# EAGLE schematic nbedmbed_mini (EAGLE 7.1.0)
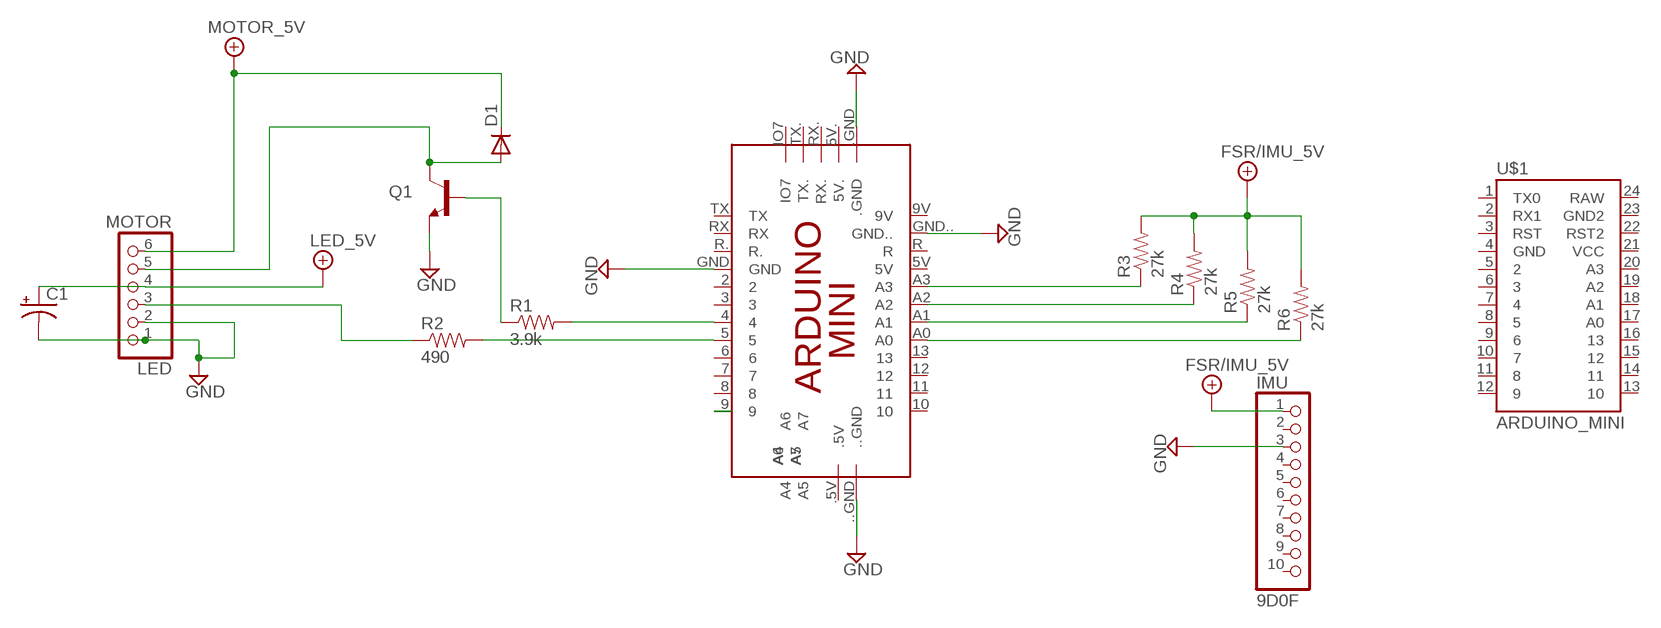
[diagram p0: schematic, sheet 1]

## Parts
C1  CAP_POLPTH1  [CPOL-RADIAL-100UF-25V]
D1  DIODE1N4148  [DIODE-1N4148]
IMU  9D0F  PINHD-1X10  [1X10-BIG]
LED  MOTOR  PINHD-1X6B  [1X06-BIG]
PCB1  ARDUINO_MINI  [ARDUINO_MINI]
Q1  TRANSISTOR_NPNTO-92-AMMO  [TO-92-AMMO]
R1  3.9k  RESISTORPTH-1/6W  [1/6W-RES]
R2  490  RESISTORPTH-1/6W  [1/6W-RES]
R3  27k  RESISTORPTH-1/6W  [1/6W-RES]
R4  27k  RESISTORPTH-1/6W  [1/6W-RES]
R5  27k  RESISTORPTH-1/6W  [1/6W-RES]
R6  27k  RESISTORPTH-1/6W  [1/6W-RES]
U$1  ARDUINO_MINI  [ARDUINO_MINI]

## Nets
FSR/IMU_5V: IMU.1 R3.2 R4.2 R5.2 R6.2
GND: C1.2(-) IMU.3 LED.1 LED.2 PCB1...GND PCB1..GND PCB1.GND PCB1.GND.. Q1.1(E)
LED_5V: C1.1(+) LED.4
MOTOR_5V: D1.C LED.6
N$1: PCB1.9
N$2: PCB1.4 R1.2
N$3: Q1.2(B) R1.1
N$4: LED.3 R2.1
N$5: PCB1.A0 R6.1
N$6: PCB1.5 R2.2
N$7: D1.A LED.5 Q1.3(C)
N$8: PCB1.A1 R5.1
N$9: PCB1.A2 R4.1
N$10: PCB1.A3 R3.1
Unconnected: IMU.2 IMU.4 IMU.5 IMU.6 IMU.7 IMU.8 IMU.9 IMU.10 PCB1.2 PCB1.3 PCB1.5V PCB1.5V. PCB1.6 PCB1.7 PCB1.8 PCB1.9V PCB1.10 PCB1.11 PCB1.12 PCB1.13 PCB1..5V PCB1.A4 PCB1.A5 PCB1.A6 PCB1.A7 PCB1.IO7 PCB1.R PCB1.R. PCB1.RX PCB1.RX. PCB1.TX PCB1.TX. U$1.1(TX0) U$1.2(RX1) U$1.3(RST) U$1.4(GND) U$1.5 U$1.6 U$1.7 U$1.8 U$1.9 U$1.10 U$1.11 U$1.12 U$1.13 U$1.14 U$1.15 U$1.16 U$1.17(A0) U$1.18(A1) U$1.19(A2) U$1.20(A3) U$1.21(VCC) U$1.22(RST2) U$1.23(GND2) U$1.24(RAW)

## Library data of the parts
C1 = SparkFun-Capacitors:CAP_POL: Capacitor Polarized These are standard SMD and PTH capacitors. Normally 10uF, 47uF, and 100uF in electrolytic and tantalum varieties. Always verify the external diameter of the through hole cap, it varies with capacity, voltage, and manufacturer. The EIA devices should be standard.
D1 = SparkFun-DiscreteSemi:DIODE: Diode These are standard reverse protection diodes and small signal diodes. SMA package can handle up to about 1A. SOD-323 can handle about 200mA. What the SOD-323 package when ordering, there are some mfgs out there that are 5-pin packages.
IMU = adafruit:PINHD-1X10: Pin header 1x10 0.1" spacing With round pins
LED = adafruit:PINHD-1X6: PIN HEADER
PCB1 = E14_Arduino_revB:ARDUINO_MINI: Device for representing an Arduino Mini board with a footprint in an EAGLE design. Created by Dave Young for Element14. More EAGLE documentation at: http://www.element14.com/community/community/knode/cadsoft_eagle
Q1 = SparkFun-DiscreteSemi:TRANSISTOR_NPN: Generic NPN BJT MMBT2222A - TRANS-08049 (SOT-23, 1A 40V) MPSA42 - TRANS-09116 (SOT-23, 500mA 300V) MMBT5088LT1G - TRANS-11160 (SOT-23, 50 mA 30V)
R1-R6 = SparkFun-Resistors:RESISTOR: Resistor Basic schematic elements and footprints for 0603, 1206, and PTH resistors.
U$1 = SparkFun-Boards:ARDUINO_MINI: Arduino Pro Mini footprint